# EAGLE design zig-v5-test (EAGLE 5.10)
BOM: EXCLUDE; PARTNO: ERJ-3EKF51R0V
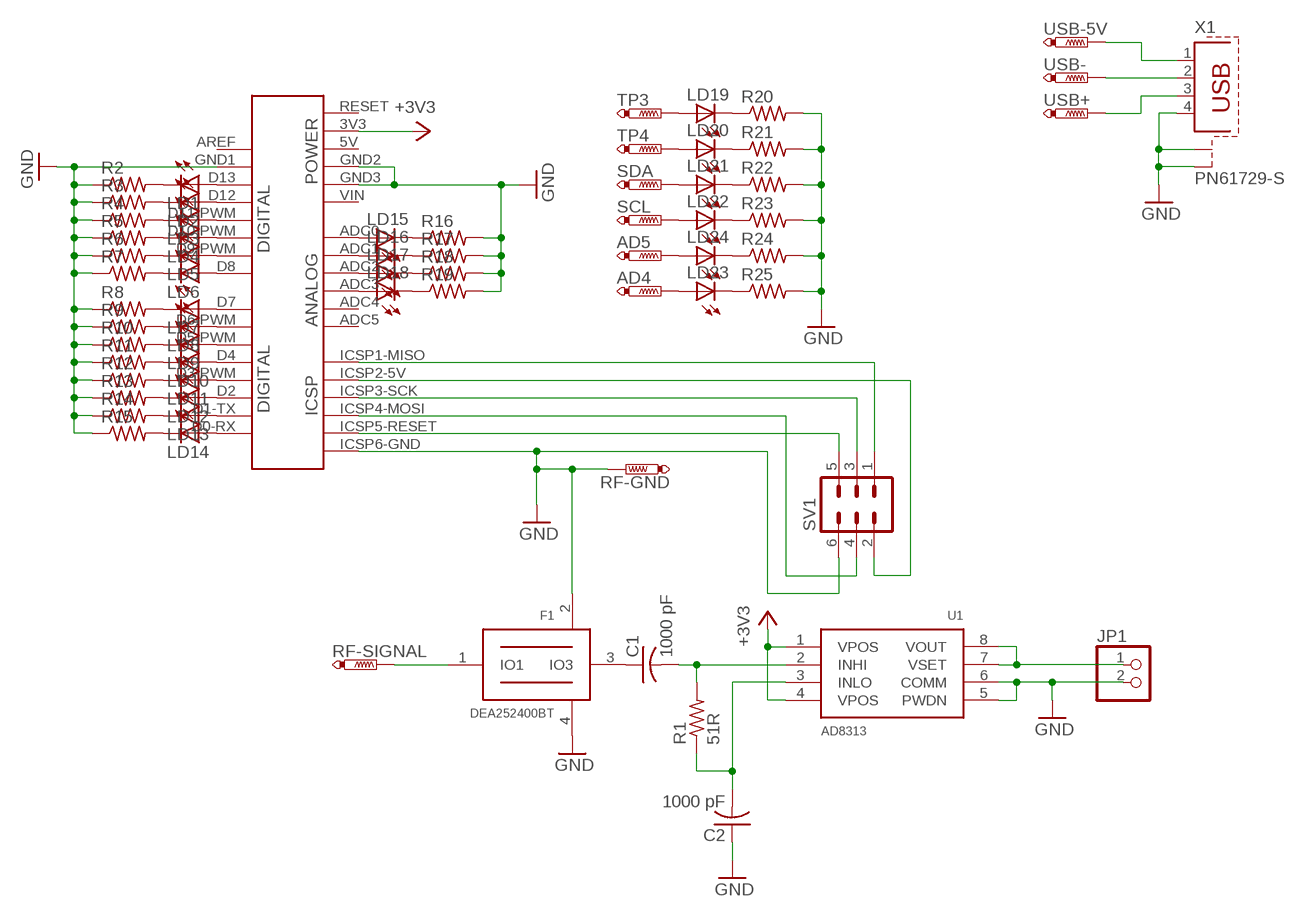
[diagram p0: schematic, sheet 1]

## Parts
AD4  PTR1PAD1-13  [P1-13]
AD5  PTR1PAD1-13  [P1-13]
C1  1000 pF  C-USC0805  [C0805]
C2  1000 pF  C-USC0805  [C0805]
DUT1  ARDUINO-2009-ICSP-TEST  [ARDUINO-2009-ICSP]
F1  DEA252400BT  [DEA2524]
JP1  PINHD-1X2  [1X02]
LD1  LED3MM  [LED3MM]
LD2  LED3MM  [LED3MM]
LD3  LED3MM  [LED3MM]
LD4  LED3MM  [LED3MM]
LD5  LED3MM  [LED3MM]
LD6  LED3MM  [LED3MM]
LD7  LED3MM  [LED3MM]
LD8  LED3MM  [LED3MM]
LD9  LED3MM  [LED3MM]
LD10  LED3MM  [LED3MM]
LD11  LED3MM  [LED3MM]
LD12  LED3MM  [LED3MM]
LD13  LED3MM  [LED3MM]
LD14  LED3MM  [LED3MM]
LD15  LED3MM  [LED3MM]
LD16  LED3MM  [LED3MM]
LD17  LED3MM  [LED3MM]
LD18  LED3MM  [LED3MM]
LD19  LED3MM  [LED3MM]
LD20  LED3MM  [LED3MM]
LD21  LED3MM  [LED3MM]
LD22  LED3MM  [LED3MM]
LD23  LED3MM  [LED3MM]
LD24  LED3MM  [LED3MM]
R1  51R  R-US_R0805  [R0805]
R2  R-US_0207/10  [0207/10]
R3  R-US_0207/10  [0207/10]
R4  R-US_0207/10  [0207/10]
R5  R-US_0207/10  [0207/10]
R6  R-US_0207/10  [0207/10]
R7  R-US_0207/10  [0207/10]
R8  R-US_0207/10  [0207/10]
R9  R-US_0207/10  [0207/10]
R10  R-US_0207/10  [0207/10]
R11  R-US_0207/10  [0207/10]
R12  R-US_0207/10  [0207/10]
R13  R-US_0207/10  [0207/10]
R14  R-US_0207/10  [0207/10]
R15  R-US_0207/10  [0207/10]
R16  R-US_0207/10  [0207/10]
R17  R-US_0207/10  [0207/10]
R18  R-US_0207/10  [0207/10]
R19  R-US_0207/10  [0207/10]
R20  R-US_0207/10  [0207/10]
R21  R-US_0207/10  [0207/10]
R22  R-US_0207/10  [0207/10]
R23  R-US_0207/10  [0207/10]
R24  R-US_0207/10  [0207/10]
R25  R-US_0207/10  [0207/10]
RF-GND  PTR1PAD1-13  [P1-13]
RF-SIGNAL  PTR1PAD1-13  [P1-13]
SCL  PTR1PAD1-13  [P1-13]
SDA  PTR1PAD1-13  [P1-13]
SV1  MA03-2  [MA03-2]
TP3  PTR1PAD1-13  [P1-13]
TP4  PTR1PAD1-13  [P1-13]
U1  AD8313  [MSOP8]
USB+  PTR1PAD1-13  [P1-13]
USB-  PTR1PAD1-13  [P1-13]
USB-5V  PTR1PAD1-13  [P1-13]
X1  PN61729-S  [PN61729-S]

## Nets
+3V3: DUT1.3V3 U1.1(VPOS) U1.4(VPOS)
GND: C2.1 DUT1.GND1 DUT1.GND2 DUT1.GND3 DUT1.ICSP6-GND(GND-ICSP) F1.2(GND) F1.4(GND) JP1.2 R2.1 R3.1 R4.1 R5.1 R6.1 R7.1 R8.1 R9.1 R10.1 R11.1 R12.1 R13.1 R14.1 R15.1 R16.2 R17.2 R18.2 R19.2 R20.2 R21.2 R22.2 R23.2 R24.2 R25.2 RF-GND.TP SV1.6 U1.5(PWDN) U1.6(COMM) X1.4 X1.S1 X1.S2
N$1: DUT1.D13 LD1.A
N$2: DUT1.D12 LD2.A
N$3: DUT1.D11-PWM(D11) LD3.A
N$4: F1.1(IO1) RF-SIGNAL.TP
N$5: JP1.1 U1.7(VSET) U1.8(VOUT)
N$6: DUT1.D10-PWM(D10) LD4.A
N$7: C1.1 F1.3(IO3)
N$8: DUT1.D9-PWM(D9) LD5.A
N$9: C2.2 R1.1 U1.3(INLO)
N$10: C1.2 R1.2 U1.2(INHI)
N$11: DUT1.D8 LD6.A
N$12: DUT1.D7 LD7.A
N$13: DUT1.ICSP1-MISO(MISO) SV1.1
N$14: DUT1.ICSP2-5V(5V-ICSP) SV1.2
N$15: DUT1.ICSP3-SCK(SCK) SV1.3
N$16: DUT1.ICSP4-MOSI(MOSI) SV1.4
N$17: DUT1.ICSP5-RESET(RESET-ICSP) SV1.5
N$18: DUT1.D6-PWM(D6) LD8.A
N$19: DUT1.D5-PWM(D5) LD9.A
N$20: DUT1.D4 LD10.A
N$21: DUT1.D3-PWM(D3) LD11.A
N$22: DUT1.D2 LD12.A
N$23: DUT1.D1-TX(D1) LD13.A
N$24: DUT1.D0-RX(D0) LD14.A
N$25: DUT1.ADC0 LD15.A
N$26: DUT1.ADC1 LD16.A
N$27: DUT1.ADC2 LD17.A
N$28: DUT1.ADC3 LD18.A
N$29: LD19.A TP3.TP
N$30: USB-5V.TP X1.1
N$31: USB-.TP X1.2
N$32: USB+.TP X1.3
N$33: LD20.A TP4.TP
N$34: LD21.A SDA.TP
N$35: LD22.A SCL.TP
N$36: AD4.TP LD23.A
N$37: AD5.TP LD24.A
N$38: LD1.K(C) R2.2
N$39: LD2.K(C) R3.2
N$40: LD3.K(C) R4.2
N$41: LD4.K(C) R5.2
N$42: LD5.K(C) R6.2
N$43: LD6.K(C) R7.2
N$44: LD7.K(C) R8.2
N$45: LD8.K(C) R9.2
N$46: LD9.K(C) R10.2
N$47: LD10.K(C) R11.2
N$48: LD11.K(C) R12.2
N$49: LD12.K(C) R13.2
N$50: LD13.K(C) R14.2
N$51: LD14.K(C) R15.2
N$52: LD15.K(C) R16.1
N$53: LD16.K(C) R17.1
N$54: LD17.K(C) R18.1
N$55: LD18.K(C) R19.1
N$56: LD19.K(C) R20.1
N$57: LD20.K(C) R21.1
N$58: LD21.K(C) R22.1
N$59: LD22.K(C) R23.1
N$60: LD24.K(C) R24.1
N$61: LD23.K(C) R25.1
Unconnected: DUT1.5V DUT1.ADC4 DUT1.ADC5 DUT1.AREF DUT1.RESET DUT1.VIN

## Library data of the parts
AD4 AD5 RF-GND RF-SIGNAL SCL SDA TP3 TP4 USB+ USB- USB-5V = testpad:PTR1: TEST PIN
C1 C2 = resistor:C-US: CAPACITOR, American symbol
DUT1 = test-fixtures:ARDUINO-2009-ICSP-TEST
F1 = atmega128rfa1:DEA252400BT: TDK DEA252400BT 2.45 GHz bandpass filter
JP1 = pinhead:PINHD-1X2: PIN HEADER
LD1-LD24 = led:LED: LED OSRAM: - CHIPLED LG R971, LG N971, LY N971, LG Q971, LY Q971, LO R971, LY R971 LH N974, LH R974 LS Q976, LO Q976, LY Q976 LO Q996 - Hyper CHIPLED LW Q18S LB Q993, LB Q99A, LB R99A - SideLED LS A670, LO A670, LY A670, LG A670, LP A670 LB A673, LV A673, LT A673, LW A673 LH A674 LY A675 LS A676, LA A676, LO A676, LY A676, LW A676 LS A679, LY A679, LG A679 - Hyper Micro SIDELED® LS Y876, LA Y876, LO Y876, LY Y876 LT Y87S - SmartLED LW L88C, LW L88S LB L89C, LB L89S, LG L890 LS L89K, LO L89K, LY L89K LS L896, LA L896, LO L896, LY L896 - TOPLED LS T670, LO T670, LY T670, LG T670, LP T670 LSG T670, LSP T670, LSY T670, LOP T670, LYG T670 LG T671, LOG T671, LSG T671 LB T673, LV T673, LT T673, LW T673 LH T674 LS T676, LA T676, LO T676, LY T676, LB T676, LH T676, LSB T676, LW T676 LB T67C, LV T67C, LT T67C, LS T67K, LO T67K, LY T67K, LW E67C LS E67B, LA E67B, LO E67B, LY E67B, LB E67C, LV E67C, LT E67C LW T67C LS T679, LY T679, LG T679 LS T770, LO T770, LY T770, LG T770, LP T770 LB T773, LV T773, LT T773, LW T773 LH T774 LS E675, LA E675, LY E675, LS T675 LS T776, LA T776, LO T776, LY T776, LB T776 LHGB T686 LT T68C, LB T68C - Hyper Mini TOPLED® LB M676 - Mini TOPLED Santana® LG M470 LS M47K, LO M47K, LY M47K Source: http://www.osram.convergy.de/
R1-R25 = resistor:R-US_: RESISTOR, American symbol
SV1 = con-lstb:MA03-2: PIN HEADER
U1 = atmega128rfa1:AD8313
X1 = con-berg:PN61729-S: BERG USB connector

## Board
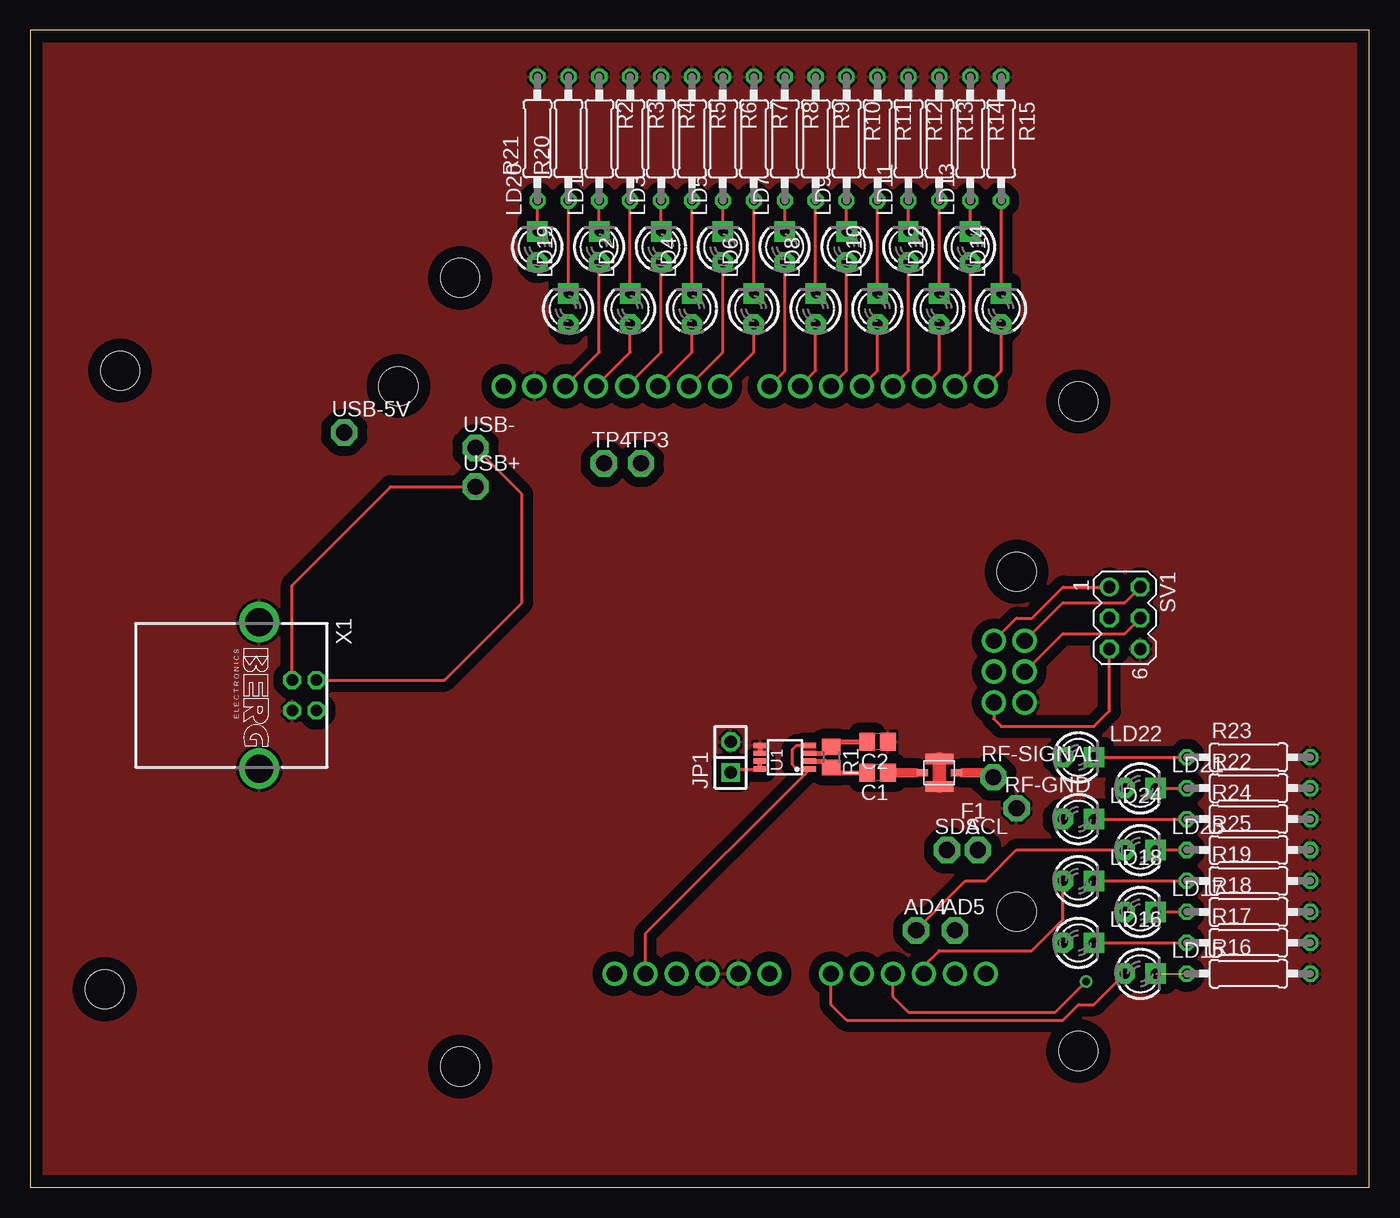
[diagram p1: board, top side]
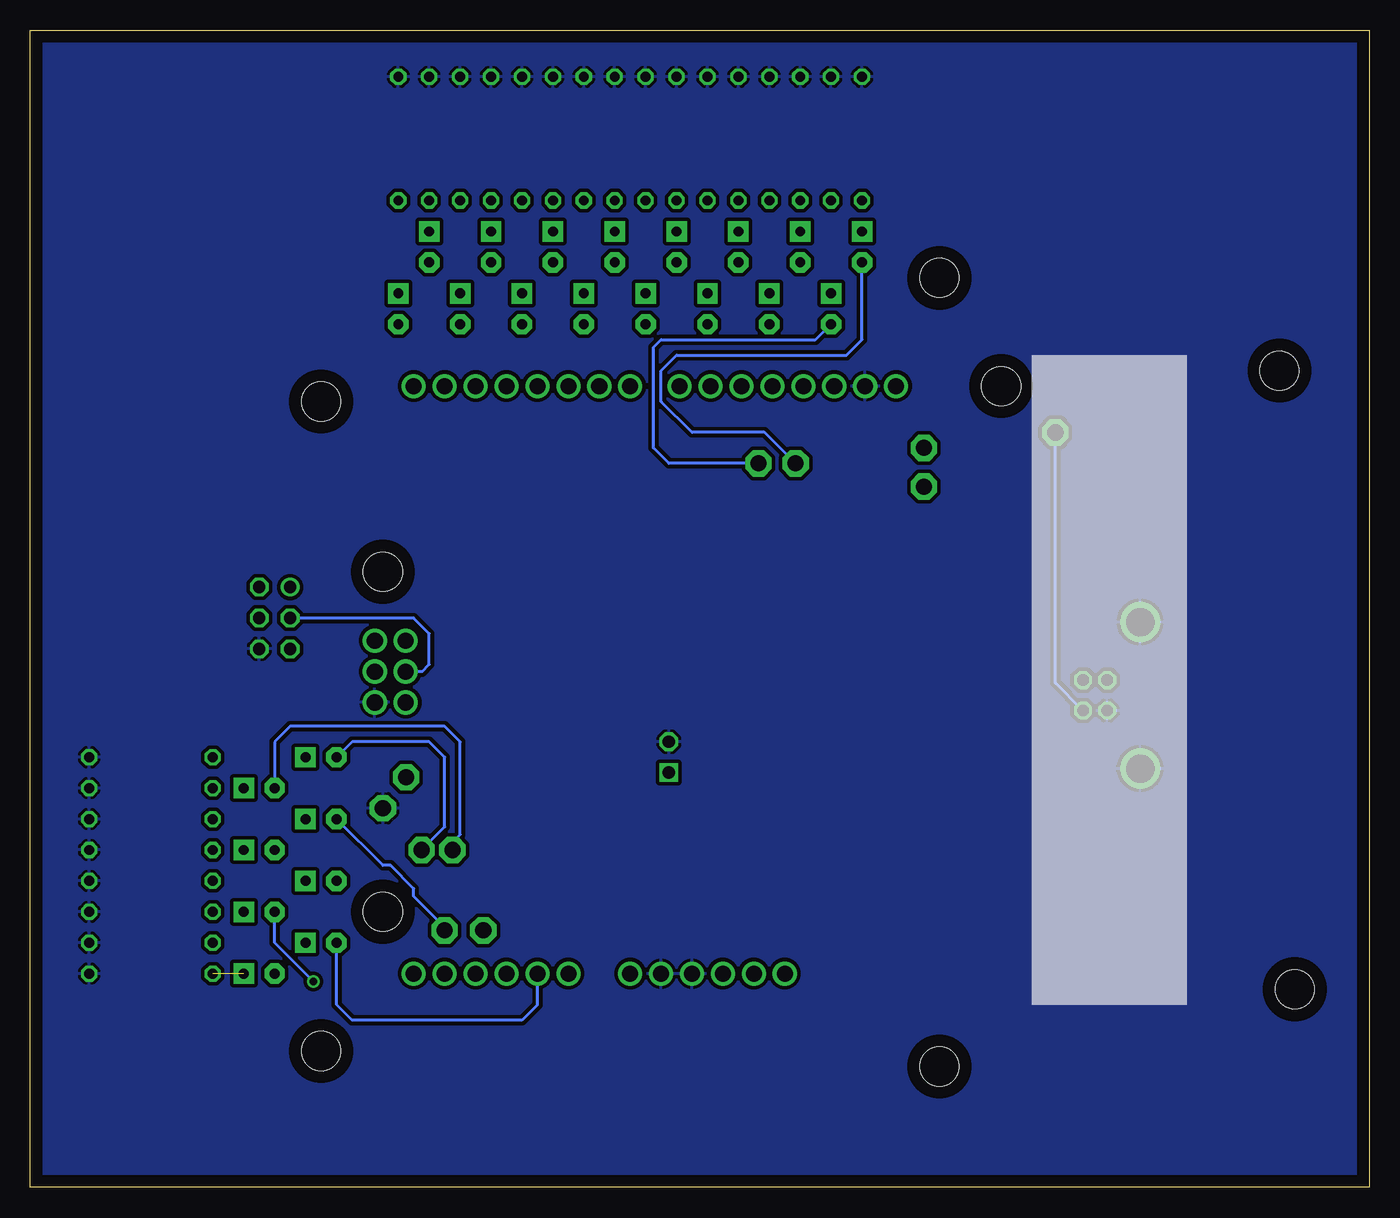
[diagram p2: board, bottom side, seen from below]

Size 109.98 x 95 mm. Coordinates in mm from the lower left corner, seen from the top.
Outline: 0,0 109.98,0 109.98,95 0,95 0,0
Copper layers (1*16): Top 0.035mm / dielectric 1.5mm / Bottom 0.035mm
Design rules "default": minimum track width 10mil, minimum drill 24mil, track to track 8mil, track to pad 8mil, pad to pad 8mil, via to via 8mil, smd to smd 8mil, copper to edge 40mil, drill to drill 8mil, minimum pad ring 10mil, minimum via ring 8mil, stop-mask expansion 4mil, vias tented up to drill 0mil, thermal gap 10mil
Holes 3.2 mm at 7.37,67.06 35.31,74.68 86.11,64.52 86.11,11.18 35.31,9.91 6.1,16.26

### Footprints (pad centres in the part's own frame; a part is rotated, then mirrored left to right if it is on the bottom)
P1-13 = drill 1.321 pad 2.159 octagon: TP 0,0
C0805 = smd 1.3 x 1.5: 1 -0.85,0; 2 0.85,0
ARDUINO-2009-ICSP = drill 1.321 round: 3V3 35.56,2.54; 5V 38.1,2.54; ADC0 50.8,2.54; ADC1 53.34,2.54; ADC2 55.88,2.54; ADC3 58.42,2.54; ADC4 60.96,2.54; ADC5 63.5,2.54; AREF 23.876,50.8; D0-RX 63.5,50.8; D1-TX 60.96,50.8; D2 58.42,50.8; D3-PWM 55.88,50.8; D4 53.34,50.8; D5-PWM 50.8,50.8; D6-PWM 48.26,50.8; D7 45.72,50.8; D8 41.656,50.8; D9-PWM 39.116,50.8; D10-PWM 36.576,50.8; D11-PWM 34.036,50.8; D12 31.496,50.8; D13 28.956,50.8; GND1 26.416,50.8; GND2 40.64,2.54; GND3 43.18,2.54; ICSP1-MISO 64.16,29.896; ICSP2-5V 66.7,29.896; ICSP3-SCK 64.16,27.356; ICSP4-MOSI 66.7,27.356; ICSP5-RESET 64.16,24.816; ICSP6-GND 66.7,24.816; RESET 33.02,2.54; VIN 45.72,2.54 | hole 3.2: 15.24,50.8; 66.04,35.56; 66.04,7.62
DEA2524 = smd 0.9 x 0.6: 1 -1.4,0; 3 1.4,0 | smd 2.3 x 0.85: 2 0,1.125; 4 0,-1.125
1X02 = drill 1.016 square: 1 -1.27,0 | drill 1.016 octagon: 2 1.27,0
LED3MM = drill 0.813 pad 1.676 octagon: A -1.27,0 | drill 0.813 pad 1.676 square: K 1.27,0
R0805 = smd 1.3 x 1.5: 1 -0.85,0; 2 0.85,0
0207/10 = drill 0.813 octagon: 1 -5.08,0; 2 5.08,0
MA03-2 = drill 1.016 round: 1 -2.54,-1.27 | drill 1.016 octagon: 2 -2.54,1.27; 3 0,-1.27; 4 0,1.27; 5 2.54,-1.27; 6 2.54,1.27
MSOP8 = smd 0.45 x 1: 1 -0.975,-2.05; 2 -0.325,-2.05; 3 0.325,-2.05; 4 0.975,-2.05; 5 0.975,2.05; 6 0.325,2.05; 7 -0.325,2.05; 8 -0.975,2.05
PN61729-S = drill 0.95 octagon: 1 1.25,4.71; 2 -1.25,4.71; 3 -1.25,2.71; 4 1.25,2.71 | drill 2.3 pad 2.9 round: S1 -6.02,0; S2 6.02,0

### Placement (x,y rotation side)
AD4  72.77,21.08 0 top
AD5  75.95,21.08 0 top
C1  69.6,34.04 180 top
C2  69.6,36.58 180 top
DUT1  14.99,14.99 0 top
F1  74.68,34.04 180 top
JP1  57.53,35.31 90 top
LD1  46.74,77.22 90 top
LD2  49.28,72.14 90 top
LD3  51.82,77.22 90 top
LD4  54.36,72.14 90 top
LD5  56.9,77.22 90 top
LD6  59.44,72.14 90 top
LD7  61.98,77.22 90 top
LD8  64.52,72.14 90 top
LD9  67.06,77.22 90 top
LD10  69.6,72.14 90 top
LD11  72.14,77.22 90 top
LD12  74.68,72.14 90 top
LD13  77.22,77.22 90 top
LD14  79.76,72.14 90 top
LD15  91.19,17.53 0 top
LD16  86.11,20.07 0 top
LD17  91.19,22.61 0 top
LD18  86.11,25.15 0 top
LD19  44.2,72.14 90 top
LD20  41.66,77.22 90 top
LD21  91.19,32.77 0 top
LD22  86.11,35.31 0 top
LD23  91.19,27.69 0 top
LD24  86.11,30.23 0 top
R1  65.79,35.31 270 top
R2  46.74,86.11 270 top
R3  49.28,86.11 270 top
R4  51.82,86.11 270 top
R5  54.36,86.11 270 top
R6  56.9,86.11 270 top
R7  59.44,86.11 270 top
R8  61.98,86.11 270 top
R9  64.52,86.11 270 top
R10  67.06,86.11 270 top
R11  69.6,86.11 270 top
R12  72.14,86.11 270 top
R13  74.68,86.11 270 top
R14  77.22,86.11 270 top
R15  79.76,86.11 270 top
R16  100.08,17.53 0 top
R17  100.08,20.07 0 top
R18  100.08,22.61 0 top
R19  100.08,25.15 0 top
R20  44.2,86.11 90 top
R21  41.66,86.11 90 top
R22  100.08,32.77 0 top
R23  100.08,35.31 0 top
R24  100.08,30.23 0 top
R25  100.08,27.69 0 top
RF-GND  81.03,31.12 0 top
RF-SIGNAL  79.12,33.66 0 top
SCL  77.85,27.69 0 top
SDA  75.31,27.69 0 top
SV1  89.92,46.74 270 top
TP3  50.17,59.44 0 top
TP4  47.12,59.44 0 top
U1  61.98,35.31 90 top
USB+  36.58,57.53 0 top
USB-  36.58,60.71 0 top
USB-5V  25.78,61.98 0 top
X1  18.8,40.39 270 top

### Tracks (layer width: path | path; a pad name or v marks a point on that pad's centre or on a via)
+3V3
  Top 0.254: U1.4 62.95,36.28 62.61,35.94 62.61,34.67 62.95,34.33 U1.1 50.55,20.85 DUT1.3V3
GND
  Top 0.406: U1.5 U1.6
  Top 1.1: F1.4 F1.2
  pour Top (isolate 0.813): -0.25,95 110.24,95 110.24,-0.25 -0.25,-0.25
  pour Bottom (isolate 0.305): -0.25,95 110.24,95 110.24,-0.25 -0.25,-0.25
N$1
  Top 0.254: LD1.A 46.74,68.58 DUT1.D13
N$2
  Top 0.254: LD2.A 49.28,68.58 DUT1.D12
N$3
  Top 0.254: LD3.A 51.82,68.58 DUT1.D11-PWM
N$4
  Top 0.254: F1.1 76.58,34.04
  Top 0.8: RF-SIGNAL.TP 78.87,33.66 78.49,34.04 76.58,34.04
N$5
  Top 0.254: U1.8 57.83,34.33 JP1.1
  Top 0.406: U1.8 U1.7
N$6
  Top 0.254: LD4.A 54.36,68.58 DUT1.D10-PWM
N$7
  Top 0.391: 72.77,34.04 F1.3
  Top 0.8: C1.1 72.77,34.04
N$8
  Top 0.254: LD5.A 56.9,68.58 DUT1.D9-PWM
N$9
  Top 0.391: U1.3 65.26,35.63 R1.1 66.21,36.58 C2.2
N$10
  Top 0.391: U1.2 65.26,34.98 R1.2 66.21,34.04 C1.2
N$11
  Top 0.254: LD6.A 59.44,68.58 DUT1.D8
N$12
  Top 0.254: LD7.A 61.98,67.06 DUT1.D7
N$13
  Top 0.254: DUT1.ICSP1-MISO 79.17,44.88 81.03,46.74 82.3,46.74 84.84,49.28 SV1.1
N$14
  Top 0.254: DUT1.ICSP2-5V 81.69,44.86 84.84,48.01 89.92,48.01 SV1.2
N$15
  Bottom 0.254: DUT1.ICSP3-SCK 77.8,42.34 77.22,42.93 77.22,45.47 78.49,46.74 SV1.3
N$16
  Top 0.254: DUT1.ICSP4-MOSI 81.71,42.34 84.84,45.47 89.92,45.47 SV1.4
N$17
  Top 0.254: DUT1.ICSP5-RESET 79.15,38.46 79.76,37.85 87.38,37.85 88.65,39.12 SV1.5
N$18
  Top 0.254: LD8.A 64.52,67.06 DUT1.D6-PWM
N$19
  Top 0.254: LD9.A 67.06,67.06 DUT1.D5-PWM
N$20
  Top 0.254: LD10.A 69.6,67.06 DUT1.D4
N$21
  Top 0.254: LD11.A 72.14,67.06 DUT1.D3-PWM
N$22
  Top 0.254: LD12.A 74.68,67.06 DUT1.D2
N$23
  Top 0.254: LD13.A 77.22,67.06 DUT1.D1-TX
N$24
  Top 0.254: LD14.A 79.76,67.06 DUT1.D0-RX
N$25
  Top 0.254: DUT1.ADC0 65.79,14.99 67.06,13.72 84.84,13.72 86.11,14.99 87.38,14.99 LD15.A
N$26
  Bottom 0.254: LD16.A 84.84,14.99 83.57,13.72 69.6,13.72 68.33,14.99 DUT1.ADC1
N$27  (via drill 0.6)
  Top 0.254: v86.74,16.89 84.2,14.35 72.14,14.35 70.87,15.62 DUT1.ADC2
  Bottom 0.254: LD17.A 89.92,20.07 v86.74,16.89
N$28
  Top 0.254: LD18.A 84.84,21.97 82.3,19.43 74.68,19.43 73.41,18.16 DUT1.ADC3
N$29
  Bottom 0.254: LD19.A 45.47,69.6 58.17,69.6 58.8,68.96 58.8,60.71 57.53,59.44 TP3.TP
N$30
  Bottom 0.254: USB-5V.TP 25.78,41.41 X1.1
N$31
  Top 0.254: X1.2 34.02,41.64 40.39,48.01 40.39,56.9 USB-.TP
N$32
  Top 0.254: X1.3 21.51,49.45 29.59,57.53 USB+.TP
N$33
  Bottom 0.254: LD20.A 41.66,69.6 42.93,68.33 56.9,68.33 58.17,67.06 58.17,64.52 55.63,61.98 49.66,61.98 TP4.TP
N$34
  Bottom 0.254: SDA.TP 75.31,28.32 74.68,28.96 74.68,36.58 75.95,37.85 88.65,37.85 89.92,36.58 LD21.A
N$35
  Bottom 0.254: LD22.A 83.57,36.58 77.22,36.58 75.95,35.31 75.95,29.59 SCL.TP
N$36
  Top 0.254: LD23.A 81.03,27.69 78.49,25.15 76.83,25.15 AD4.TP
N$37
  Bottom 0.254: AD5.TP 75.95,21.34 78.49,23.88 78.49,24.51 80.39,26.42 81.03,26.42 LD24.A
N$38
  Top 0.254: LD1.K R2.2
N$39
  Top 0.254: LD2.K R3.2
N$40
  Top 0.254: LD3.K R4.2
N$41
  Top 0.254: LD4.K R5.2
N$42
  Top 0.254: LD5.K R6.2
N$43
  Top 0.254: LD6.K R7.2
N$44
  Top 0.254: LD7.K R8.2
N$45
  Top 0.254: LD8.K R9.2
N$46
  Top 0.254: LD9.K R10.2
N$47
  Top 0.254: LD10.K R11.2
N$48
  Top 0.254: LD11.K R12.2
N$49
  Top 0.254: LD12.K R13.2
N$50
  Top 0.254: LD13.K R14.2
N$51
  Top 0.254: LD14.K R15.2
N$52  (1 unrouted)
N$53
  Top 0.254: LD16.K R17.1
N$54
  Top 0.254: LD17.K R18.1
N$55
  Top 0.254: LD18.K R19.1
N$56
  Top 0.254: LD19.K R20.1
N$57
  Top 0.254: LD20.K R21.1
N$58
  Top 0.254: LD21.K R22.1
N$59
  Top 0.254: LD22.K R23.1
N$60
  Top 0.254: LD24.K R24.1
N$61
  Top 0.254: LD23.K R25.1